# EAGLE schematic Pure VCA (EAGLE 8.3.1)
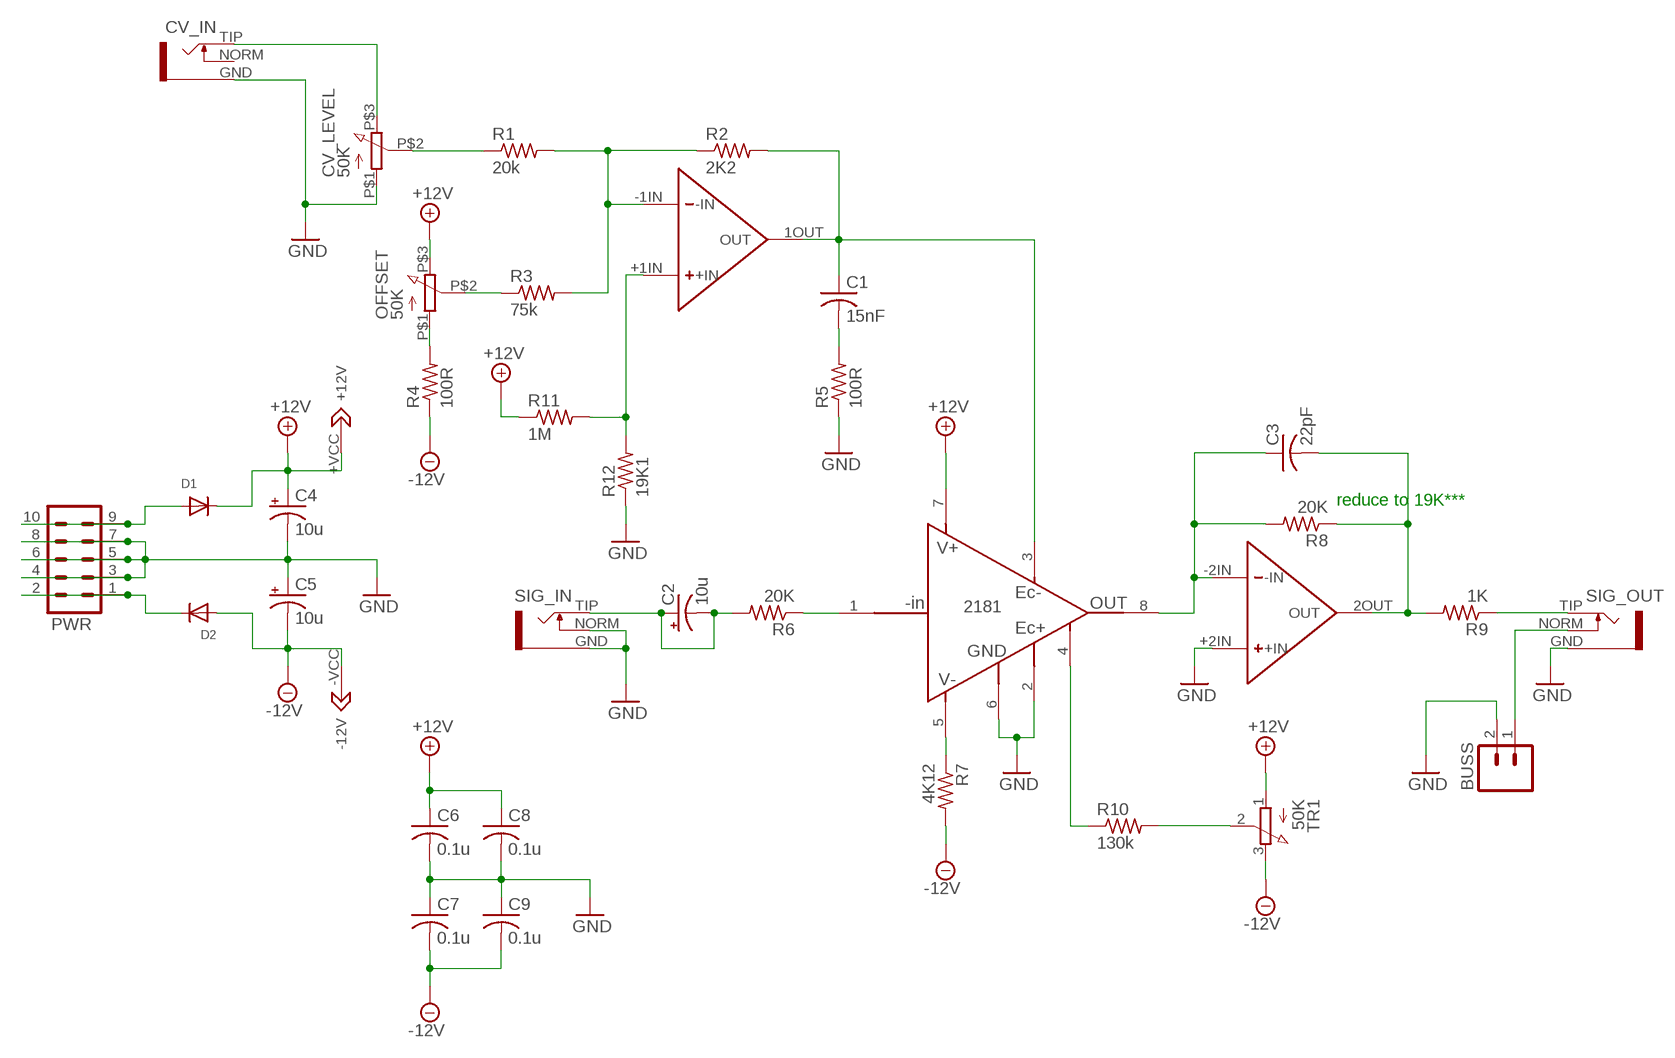
[diagram p0: schematic, sheet 1]

## Parts
BUSS  M02PTH  [1X02]
C1  15nF  C-USC0805K  [C0805K]
C2  10u  CPOL-US153CLV-0505  [153CLV-0505]
C3  22pF  C-USC0805K  [C0805K]
C4  10u  CPOL-US153CLV-0505  [153CLV-0505]
C5  10u  CPOL-US153CLV-0505  [153CLV-0505]
C6  0.1u  C-USC0805K  [C0805K]
C7  0.1u  C-USC0805K  [C0805K]
C8  0.1u  C-USC0805K  [C0805K]
C9  0.1u  C-USC0805K  [C0805K]
CV_IN  S_JACK  [S_JACK]
CV_LEVEL  50K  Q-POT  [Q-POT]
D1  DIODESMA  [SMADIODE]
D2  DIODESMA  [SMADIODE]
OFFSET  50K  Q-POT  [Q-POT]
PWR  M05X2SHD  [2X5-SHROUDED]
R1  20k  R-US_R0805  [R0805]
R2  2K2  R-US_R0805  [R0805]
R3  75k  R-US_R0805  [R0805]
R4  100R  R-US_R0805  [R0805]
R5  100R  R-US_R0805  [R0805]
R6  20K  R-US_R0805  [R0805]
R7  4K12  R-US_R0805  [R0805]
R8  20K  R-US_R0805  [R0805]
R9  1K  R-US_R0805  [R0805]
R10  130k  R-US_R0805  [R0805]
R11  1M  R-US_R0805  [R0805]
R12  19K1  R-US_R0805  [R0805]
SIG_IN  S_JACK  [S_JACK]
SIG_OUT  S_JACK  [S_JACK]
TR1  50K  TRIM_3269W  [TRIM_3269W]
U1  DUAL_OPAMP  [DUAL_OPAMP]
U2  THAT_2181_SMD  [SOIC--8]

## Nets
+12V: C4.+ C6.1 C8.1 D1.C OFFSET.P$3 R11.1 TR1.1 U1.+VCC(+12V) U2.7(V+)
-12V: C5.- C7.2 C9.2 D2.A R4.1 R7.2 TR1.3 U1.-VCC(-12V)
GND: BUSS.2 C4.- C5.+ C6.2 C7.1 C8.2 C9.1 CV_IN.GND CV_LEVEL.P$1 PWR.3 PWR.4 PWR.5 PWR.6 PWR.7 PWR.8 R5.1 R12.1 SIG_IN.GND SIG_IN.NORM SIG_OUT.GND U1.+2IN(+IN) U2.2(EC+) U2.6(GND)
N$1: CV_IN.TIP CV_LEVEL.P$3
N$2: R1.2 R2.1 R3.2 U1.-1IN(-IN)
N$3: CV_LEVEL.P$2 R1.1
N$4: OFFSET.P$1 R4.2
N$5: C1.1 R2.2 U1.1OUT(OUT) U2.3(EC-)
N$6: OFFSET.P$2 R3.1
N$7: C1.2 R5.2
N$8: R9.1 SIG_OUT.TIP
N$9: R6.1 U2.1(-IN)
N$11: C2.+ C2.- R6.2 SIG_IN.TIP
N$12: BUSS.1 SIG_OUT.NORM
N$13: R7.1 U2.5(V-)
N$14: R11.2 R12.2 U1.+1IN(+IN)
N$15: C3.1 R8.2 U1.-2IN(-IN) U2.8(OUT)
N$16: C3.2 R8.1 R9.2 U1.2OUT(OUT)
N$17: R10.1 U2.4(SYM)
N$18: R10.2 TR1.2
N$38: D1.A PWR.9 PWR.10
N$50: D2.C PWR.1 PWR.2
Unconnected: CV_IN.NORM

## Notes on the sheet
- reduce to 19K***

## Library data of the parts
BUSS = SparkFun-Connectors:M02: Standard 2-pin 0.1" header. Use with - straight break away headers ( PRT-00116) - right angle break away headers (PRT-00553) - swiss pins (PRT-00743) - machine pins (PRT-00117) - female headers (PRT-00115) Molex polarized connector foot print use with: PRT-08233 with associated crimp pins and housings. 2.54_SCREWTERM for use with PRT-10571. 3.5mm Screw Terminal footprints for PRT-08084 5mm Screw Terminal footprints for use with PRT-08433
C1 C3 C6-C9 = rcl:C-US: CAPACITOR, American symbol
C2 C4 C5 = rcl:CPOL-US: POLARIZED CAPACITOR, American symbol
CV_IN SIG_IN SIG_OUT = INSTRUO:S_JACK
CV_LEVEL OFFSET = INSTRUO:Q-POT
D1 D2 = adafruit:DIODE: Diode SMADIODE - SMA Surface Mount Package 20V 1A Schottky Diode Digikey: 641-1014-6-ND DO-1N4148 - Through Hole Small Current Diode SOD-123 20V 1 A (.5mV Vf) Schottky Diode - Digikey: MBRX120TPMSCT-ND SOD-323 10V 570mA (.38mV Vf, 3ns) Schottky Diode - Digikey: ZLLS410CT-ND SOD-523 30V 30mA Schottky Diode (RB751S-40TE61) - Digikey: RB751S-40TE61CT-ND SOT23-R/W - SOT23 Package (R = Solder Paste/Reflow Ovens, W = Hand-Soldering) BAT54Film 40V 300mA - Digikey: 497-7162-1-ND
PWR = SparkFun-Connectors:M05X2: Header 5x2 Standard 10-pin dual row 0.1" header. Commonly used with AVR-ISP. Use with Spark Fun Electronics SKU: PRT-00778
R1-R12 = rcl:R-US_: RESISTOR, American symbol
TR1 = INSTRUO:TRIM_3269W: Manufacturer Part #: 3269W-1-101GLF
U1 = INSTRUO:DUAL_OPAMP
U2 = INSTRUO:THAT_2181_SMD